# EAGLE design Projeto Lora (EAGLE 9.6.2)
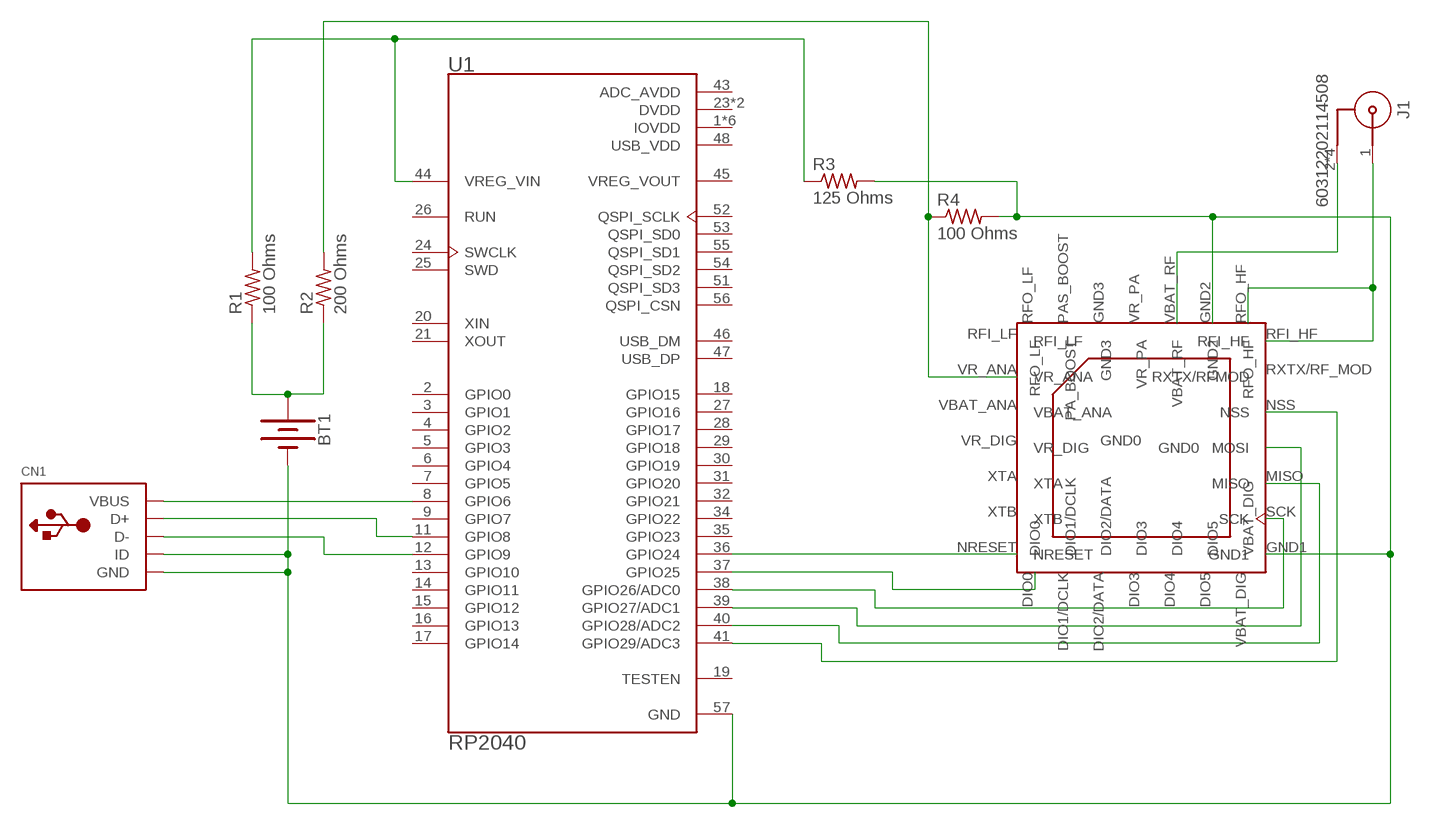
[diagram p0: schematic, sheet 1]

## Parts
BT1  BATTERY-9V  [BATTCON_9V]
CN1  USBMINIB  [USB-MINIB]
J1  60312202114508  [60312202114508]
R1  100 Ohms  R-US_01005  [R01005]
R2  200 Ohms  R-US_01005  [R01005]
R3  125 Ohms  R-US_01005  [R01005]
R4  100 Ohms  R-US_01005  [R01005]
U1  RP2040  [QFN40P700X700X90-57N]
U$1  LORA-SX1278  [PDIP]

## Nets
N$1: U1.38(GPIO26/ADC0) U$1.SCK
N$2: U1.39(GPIO27/ADC1) U$1.MOSI
N$3: U1.40(GPIO28/ADC2) U$1.MISO
N$4: U1.41(GPIO29/ADC3) U$1.NSS
N$5: U1.36(GPIO24) U$1.NRESET
N$6: U1.37(GPIO25) U$1.DIO0
N$7: J1.1 U$1.RFI_HF U$1.RFO_HF
N$9: R2.2 R4.1 U$1.VR_ANA
N$10: J1.2 J1.3 J1.4 J1.5 U$1.VBAT_RF
N$11: CN1.D+ U1.11(GPIO8)
N$12: BT1.+ R1.1 R2.1
N$13: CN1.VBUS U1.8(GPIO6)
N$14: R1.2 R3.1 U1.44(VREG_VIN)
N$15: CN1.D- U1.12(GPIO9)
N$17: BT1.- CN1.GND CN1.ID R3.2 R4.2 U1.57(GND) U$1.GND1 U$1.GND2
Unconnected: U1.2(GPIO0) U1.3(GPIO1) U1.4(GPIO2) U1.5(GPIO3) U1.6(GPIO4) U1.7(GPIO5) U1.9(GPIO7) U1.13(GPIO10) U1.14(GPIO11) U1.15(GPIO12) U1.16(GPIO13) U1.17(GPIO14) U1.18(GPIO15) U1.19(TESTEN) U1.20(XIN) U1.21(XOUT) U1.24(SWCLK) U1.25(SWD) U1.26(RUN) U1.27(GPIO16) U1.28(GPIO17) U1.29(GPIO18) U1.30(GPIO19) U1.31(GPIO20) U1.32(GPIO21) U1.34(GPIO22) U1.35(GPIO23) U1.45(VREG_VOUT) U1.46(USB_DM) U1.47(USB_DP) U1.51(QSPI_SD3) U1.52(QSPI_SCLK) U1.53(QSPI_SD0) U1.54(QSPI_SD2) U1.55(QSPI_SD1) U1.56(QSPI_CSN) U$1.DIO1/DCLK U$1.DIO2/DATA U$1.DIO3 U$1.DIO4 U$1.DIO5 U$1.PAS_BOOST(PA_BOOST) U$1.RFI_LF U$1.RFO_LF U$1.RXTX/RF_MOD(RXTX/RFMOD) U$1.XTA U$1.XTB

## Power pins joined to a net without a drawn wire
ADC_AVDD: U1.43(ADC_AVDD)
DVDD: U1.23(DVDD) U1.50(DVDD)
GND0: U$1.GND0
GND3: U$1.GND3
IOVDD: U1.1(IOVDD) U1.10(IOVDD) U1.22(IOVDD) U1.33(IOVDD) U1.42(IOVDD) U1.49(IOVDD)
USB_VDD: U1.48(USB_VDD)
VBAT_ANA: U$1.VBAT_ANA
VBAT_DIG: U$1.VBAT_DIG
VR_DIG: U$1.VR_DIG
VR_PA: U$1.VR_PA

## Library data of the parts
BT1 = SparkFun-Batteries:BATTERY: Battery - Single Cell A variety of battery chemistries, sizes, and footprints. Device List: 20MM_PTH - Coin Cell Battery Holder - 20mm (PTH) <https://www.sparkfun.com/products/783> 6.8MM_PTH - Coin Cell Battery Holder - 6.8MM(SMD) <https://www.digikey.com/product-detail/en/seiko-instruments/MS621FE-FL11E/728-1057-ND/1889208?WT.srch=1&gclid=CNOQ5a6LzdQCFZS2wAodXCkE0g> 12MM_SMD - Coin Cell Battery Holder - 12mm (SMD) <https://www.sparkfun.com/products/10592> 12MM_PTH - Coin Cell Battery Holder - 12mm (PTH) <https://www.sparkfun.com/products/7948> 20MM_SMD - 20mm Coin Cell Battery Holder (SMD) (2 legs) Used on the Big Time Watch Kit <https://www.sparkfun.com/products/11734> 20MM_SMD_4LEGS - Coin Cell Battery Holder - 20mm (SMD) <https://www.sparkfun.com/products/11892> 20MM_SMD_4LEGS_OVERPASTE - Coin Cell Battery Holder - 20mm (SMD) <https://www.sparkfun.com/products/11892> (Over-paste on the legs) 24.5MM_PTH - Coin Cell Battery Holder - 24.5mm (PTH) <https://www.sparkfun.com/products/8863> 9V - 9V Battery Holder - PC Mount Used on the SparkFun SparkPunk Sound Kit <https://www.sparkfun.com/products/11177> and SparkFun SparkPunk Sequencer Kit <https://www.sparkfun.com/products/12707> 18650 - Battery Holder - 18650 (PTH) <https://www.sparkfun.com/products/13113> AA - Battery Holder - 1xAA (PTH) <https://www.sparkfun.com/products/7949> AAA - Battery Holder - 1xAAA (PTH) <https://www.sparkfun.com/products/12718> AA_KIT - Battery Holder - 1xAA (PTH) <https://www.sparkfun.com/products/7949> Special kit package - pads only have exposed copper on one side of the board. AAA_KIT - Battery Holder - 1xAAA (PTH) <https://www.sparkfun.com/products/12718> Special kit package - pads only have exposed copper on one side of the board.; PROD_ID: BATT-10855
CN1 = adafruit:USB: USB Connectors USBMINIB - Surface Mount Female Mini-B USB Connector 4UConnector: 06564 By microbuilder.eu Thru-hole RA Female Mini-B USB Connector 4UConnector: 18732 By ladyada.net
J1 = SMDAntena:60312202114508: WR-SMA PCB End Launch Jack Round Post 1.1 mm MATERIAL PROPERTIES Insulator Material PTFE Insulator Color White Center Contact Material Beryllium Copper Center Contact Plating Gold, min. 0.76µm over Nickel Body Material Brass Body Plating Gold, min. 0.076µm over Nickel KIND PROPERTIES Interface MIL-STD-348 Connector Type SMA Gender Jack Orientation Type Straight GENERAL INFORMATION: Operating Temperature -65 °C up to +165 °C Compliance RoHS ELECTRICAL PROPERTIES Frequency Range DC~18 GHz MECHANICAL PROPERTIES Mating Cycle 500 Cycles PACKAGING PROPERTIES Packaging Tray <https://katalog.we-online.com/media/images/v2/o122847v209%20WR-SMA_60312202114508.jpg> Details see: https://katalog.we-online.com/en/em/WR-SMA_60312202114508 Updated by Ella Wu, 2019-11-07 2019(C) Würth Elektronik Check prices <https://pricing.snapeda.com/parts/60312202114508/W%C3%BCrth%20Elektronik/view-part?ref=eda>; AVAILABILITY: In Stock; DESCRIPTION: SMA Connector Jack, Female Socket 50Ohm Board Edge, End Launch Solder; MF: Würth Elektronik; MP: 60312202114508; PACKAGE: None; PRICE: None; PURCHASE-URL: https://pricing.snapeda.com/search/part/60312202114508/?ref=eda
R1-R4 = resistor:R-US_: RESISTOR, American symbol
U1 = RP2040:RP2040: Check prices <https://pricing.snapeda.com/parts/RP2040/Raspberry%20Pi/view-part?ref=eda>; AVAILABILITY: In Stock; DESCRIPTION: RP2040 chip for Raspberry Pi Pico - ARM® Cortex®-M0+ MCU 32-Bit; MF: Raspberry Pi; MP: RP2040; PACKAGE: Package; PRICE: None; PURCHASE-URL: https://pricing.snapeda.com/search/part/RP2040/?ref=eda
U$1 = SX1278:LORA-SX1278: SX1278IMLTRT

## Board
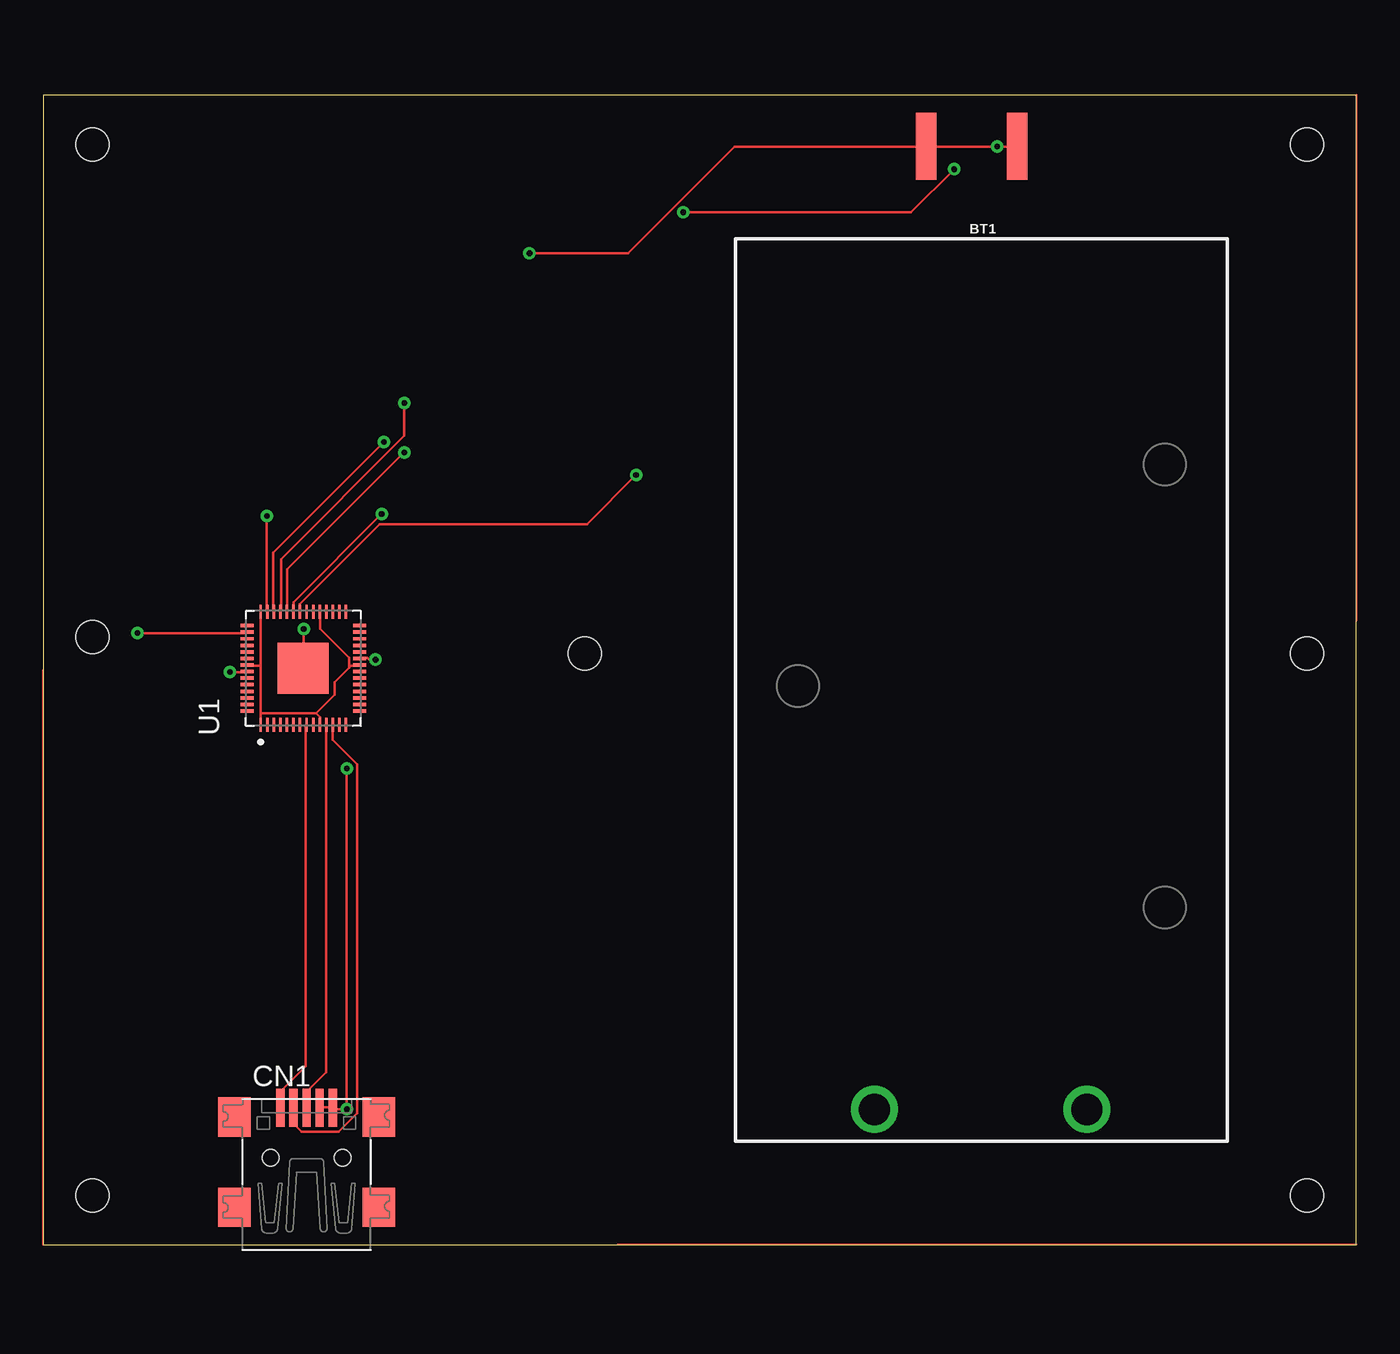
[diagram p1: board, top side]
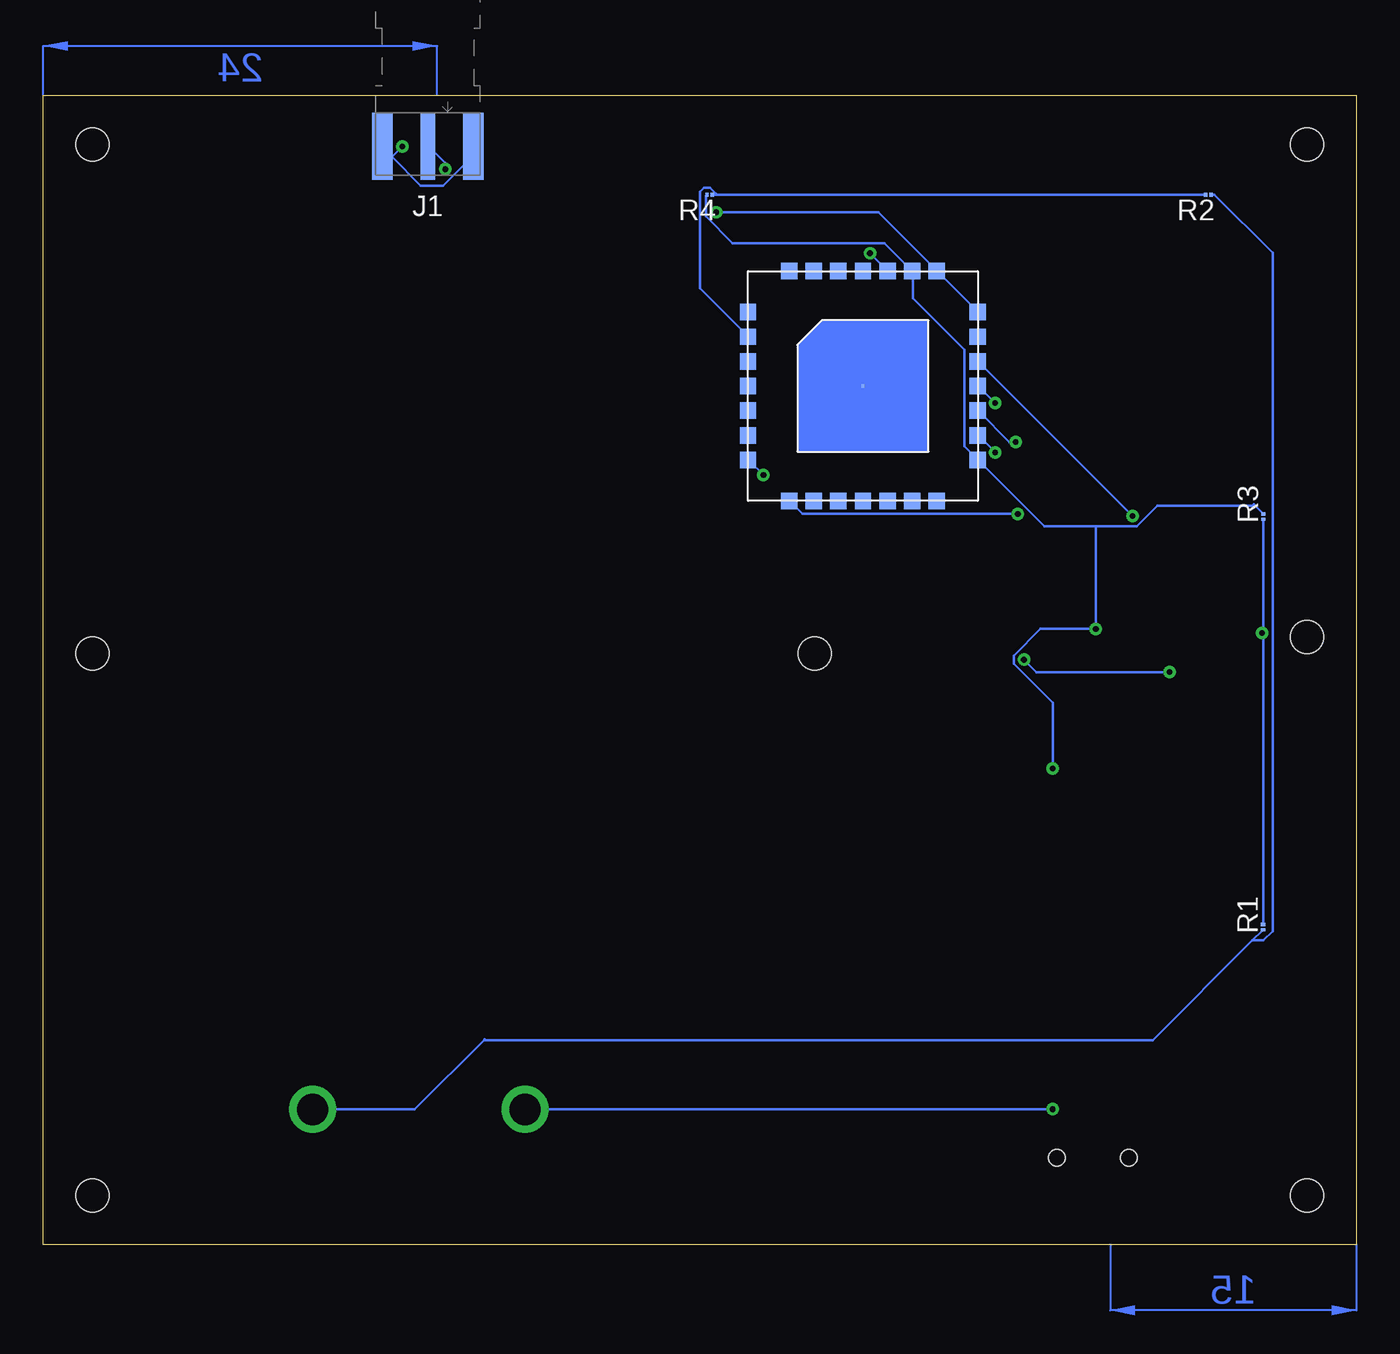
[diagram p2: board, bottom side, seen from below]

Size 80 x 70 mm. Coordinates in mm from the lower left corner, seen from the top.
Outline: 0,0 80,0 80,70 0,70 0,0
Copper layers (1*16): Top 0.035mm / dielectric 1.5mm / Bottom 0.035mm
Design rules "default": minimum track width 6mil, minimum drill 0.35mm, track to track 6mil, track to pad 6mil, pad to pad 6mil, via to via 6mil, smd to smd 6mil, copper to edge 40mil, drill to drill 6mil, minimum pad ring 10mil, minimum via ring 8mil, stop-mask expansion 4mil, vias tented up to drill 0mil, thermal gap 10mil
Holes 2 mm at 3,3 3,67 77,67 77,3 77,36 33,36 3,37

### Footprints (pad centres in the part's own frame; a part is rotated, then mirrored left to right if it is on the bottom)
BATTCON_9V = drill 1.905: + 0,0; - 0,-12.954
USB-MINIB = smd 0.5 x 2.308: D+ 0,4.064; D- -0.8,4.064; GND 1.6,4.064; ID 0.8,4.064; VBUS -1.6,4.064 | smd 2 x 2.4: GND1 -4.4,-2; GND2 -4.4,3.5; GND3 4.4,3.5; GND4 4.4,-2 | hole 1: -2.2,1; 2.2,1
60312202114508 = smd 0.9 x 4.1: 1 0,0 | smd 1.25 x 4.1: 2 -2.775,0; 3 2.775,0 | smd 1.25 x 4.1 bottom: 4 -2.775,0; 5 2.775,0
R01005 = smd 0.2 x 0.25: 1 -0.163,0; 2 0.163,0
QFN40P700X700X90-57N = smd 0.84 x 0.2: 1 -3.435,2.6; 2 -3.435,2.2; 3 -3.435,1.8; 4 -3.435,1.4; 5 -3.435,1; 6 -3.435,0.6; 7 -3.435,0.2; 8 -3.435,-0.2; 9 -3.435,-0.6; 10 -3.435,-1; 11 -3.435,-1.4; 12 -3.435,-1.8; 13 -3.435,-2.2; 14 -3.435,-2.6; 29 3.435,-2.6; 30 3.435,-2.2; 31 3.435,-1.8; 32 3.435,-1.4; 33 3.435,-1; 34 3.435,-0.6; 35 3.435,-0.2; 36 3.435,0.2; 37 3.435,0.6; 38 3.435,1; 39 3.435,1.4; 40 3.435,1.8; 41 3.435,2.2; 42 3.435,2.6 | smd 0.2 x 0.84: 15 -2.6,-3.435; 16 -2.2,-3.435; 17 -1.8,-3.435; 18 -1.4,-3.435; 19 -1,-3.435; 20 -0.6,-3.435; 21 -0.2,-3.435; 22 0.2,-3.435; 23 0.6,-3.435; 24 1,-3.435; 25 1.4,-3.435; 26 1.8,-3.435; 27 2.2,-3.435; 28 2.6,-3.435; 43 2.6,3.435; 44 2.2,3.435; 45 1.8,3.435; 46 1.4,3.435; 47 1,3.435; 48 0.6,3.435; 49 0.2,3.435; 50 -0.2,3.435; 51 -0.6,3.435; 52 -1,3.435; 53 -1.4,3.435; 54 -1.8,3.435; 55 -2.2,3.435; 56 -2.6,3.435 | smd 3.1 x 3.1: 57 0,0
PDIP = smd 1 x 1: DIO0 2.5,0; DIO1/DCLK 4,0; DIO2/DATA 5.5,0; DIO3 7,0; DIO4 8.5,0; DIO5 10,0; GND1 14,2.5; GND2 10,14; GND3 5.5,14; MISO 14,5.5; MOSI 14,7; NRESET 0,2.5; NSS 14,8.5; PAS_BOOST 4,14; RFI_HF 14,11.5; RFI_LF 0,11.5; RFO_HF 11.5,14; RFO_LF 2.5,14; RXTX/RF_MOD 14,10; SCK 14,4; VBAT_ANA 0,8.5; VBAT_DIG 11.5,0; VBAT_RF 8.5,14; VR_ANA 0,10; VR_DIG 0,7; VR_PA 7,14; XTA 0,5.5; XTB 0,4 | smd 0.2 x 0.2: GND0 7,7

### Placement (x,y rotation side)
BT1  63.59,8.24 270 top
CN1  16.05,4.28 0 top
J1  56.56,66.89 180 bottom
R1  5.68,19.34 90 bottom
R2  9.02,63.94 180 bottom
R3  5.66,44.34 90 bottom
R4  39.4,63.94 180 bottom
U1  15.85,35.1 90 top
U$1  37.06,45.29 0 bottom

### Tracks (layer width: path | path; a pad name or v marks a point on that pad's centre or on a via)
DVDD  (via drill 0.35)
  Top 0.152: v11.38,34.88 12.38,34.88 U1.50 | v20.25,35.62 19.88,35.62 19.75,35.75 19.38,35.75 U1.23
  Bottom 0.152: v11.38,34.88 19.5,34.88 v20.25,35.62
IOVDD
  Top 0.152: U1.42 13.25,35.25 | 13.25,35.25 13.25,32.38 | 13.25,32.38 U1.1 | 16.62,32.38 16.88,32.12 16.88,31.75 U1.10 | 13.25,32.38 16.62,32.38 | 13.25,35.25 12.5,35.25 U1.49 | 18.62,35.12 17.75,34.25 17.75,33.5 16.62,32.38 | 18.62,35.12 18.75,35.25 19.25,35.25 U1.22 | 18.62,35.12 18.62,35.75 16.88,37.5 16.88,38.5 U1.33
N$1  (via drill 0.35)
  Top 0.152: v22,48.25 14.88,41.12 14.88,38.62 U1.38
  Bottom 0.152: v22,48.25 23,49.25 U$1.SCK
N$2  (via drill 0.35)
  Top 0.152: v22,51.25 22,49.25 14.5,41.75 14.5,38.62 U1.39
  Bottom 0.152: v22,51.25 23,52.25 U$1.MOSI
N$3  (via drill 0.35)
  Top 0.152: v20.75,48.88 14,42.12 14,38.62 U1.40
  Bottom 0.152: v20.75,48.88 21.12,48.88 23,50.75 U$1.MISO
N$4  (via drill 0.35)
  Top 0.152: v13.62,44.38 13.62,38.62 U1.41
  Bottom 0.152: v13.62,44.38 23,53.75 U$1.NSS
N$5  (via drill 0.35)
  Top 0.152: v36.12,46.88 33.12,43.88 20.5,43.88 15.62,39 15.62,38.62 U1.36
  Bottom 0.152: v36.12,46.88 37,47.75 U$1.NRESET
N$6  (via drill 0.35)
  Top 0.152: U1.37 15.25,39.12 v20.62,44.5
  Bottom 0.152: v20.62,44.5 33.75,44.5 34.5,45.25 U$1.DIO0
N$7  (via drill 0.35)
  Top 0.152: v39,62.88 52.88,62.88 v55.5,65.5
  Bottom 0.152: U$1.RFI_HF 23.12,56.88 25.5,59.25 U$1.RFO_HF 25.62,59.38 29.12,62.88 v39,62.88 | v55.5,65.5 55.5,65.88 56.5,66.88 J1.1
N$9
  Bottom 0.152: R2.2 39,63.94 | 39,63.94 R4.1 | U$1.VR_ANA 37.12,55.38 40,58.25 40,64.12 39.75,64.38 39.38,64.38 39,64 39,63.94
N$10  (via drill 0.35)
  Top 0.152: v29.62,60.38 35.62,60.38 42.12,66.88 53.75,66.88 J1.4 53.88,66.88 v58.12,66.88 59.25,66.88 J1.5
  Bottom 0.152: 58.75,66.25 59.38,66.88 J1.5 58.75,66.25 | 58.75,66.25 57,64.5 55.62,64.5 53.88,66.25 53.88,66.88 J1.4 | v29.62,60.38 28.62,59.38 U$1.VBAT_RF | v58.12,66.88 58.75,66.25
N$11
  Top 0.152: U1.11 17.25,10.5 16.12,9.38 16.12,8.38 CN1.D+
N$12
  Bottom 0.152: BT1.+ 57.36,8.24 53.15,12.45 | 53.15,12.45 53.1,12.5 | 53.15,12.45 12.41,12.45 6.33,18.53 | 6.33,18.53 5.74,19.12 | 5.74,19.12 R1.1 | R2.1 8.64,63.94 5.1,60.4 5.1,19.1 5.67,18.53 6.33,18.53 | R1.1 5.75,19.12 5.74,19.12
N$13
  Top 0.152: U1.8 16,31.62 16,10.88 14.5,9.38 14.5,8.38 CN1.VBUS
N$14  (via drill 0.35)
  Top 0.152: v5.75,37.25 12.38,37.25 U1.44
  Bottom 0.152: R1.2 5.68,37.25 | 5.68,37.25 5.68,44.16 R3.1 | v5.75,37.25 5.68,37.25
N$15
  Top 0.152: CN1.D- 15.25,7.38 15.75,6.88 18,6.88 19.12,8 19.12,29.25 17.62,30.75 17.62,31.62 U1.12
N$17  (via drill 0.35)
  Top 0.152: U1.57 15.88,35.12 v15.88,37.5 | CN1.ID 16.88,8.38 17.62,8.38 CN1.GND 17.75,8.25 v18.5,8.25 v18.5,29
  Bottom 0.152: R3.2 6.2,45.05 | 6.2,45.05 6.26,45.1 | v18.5,8.25 50.62,8.25 BT1.- | R4.2 39.62,63.88 39.62,62.62 38,61 28.75,61 27.12,59.38 U$1.GND2 27,59.25 27,57.62 23.88,54.5 23.88,48.62 23.12,47.88 U$1.GND1 23,47.75 19,43.75 15.88,43.75 | 15.88,43.75 13.38,43.75 12.12,45 6.25,45 6.2,45.05 | 15.88,43.75 v15.88,37.5 19.25,37.5 20.88,35.88 20.88,35.38 18.5,33 v18.5,29
(copper drawn outside any net)
  shapes: Bottom area x2, Top area x3